# EAGLE design HVAL_TSAL (EAGLE 8.4.1)
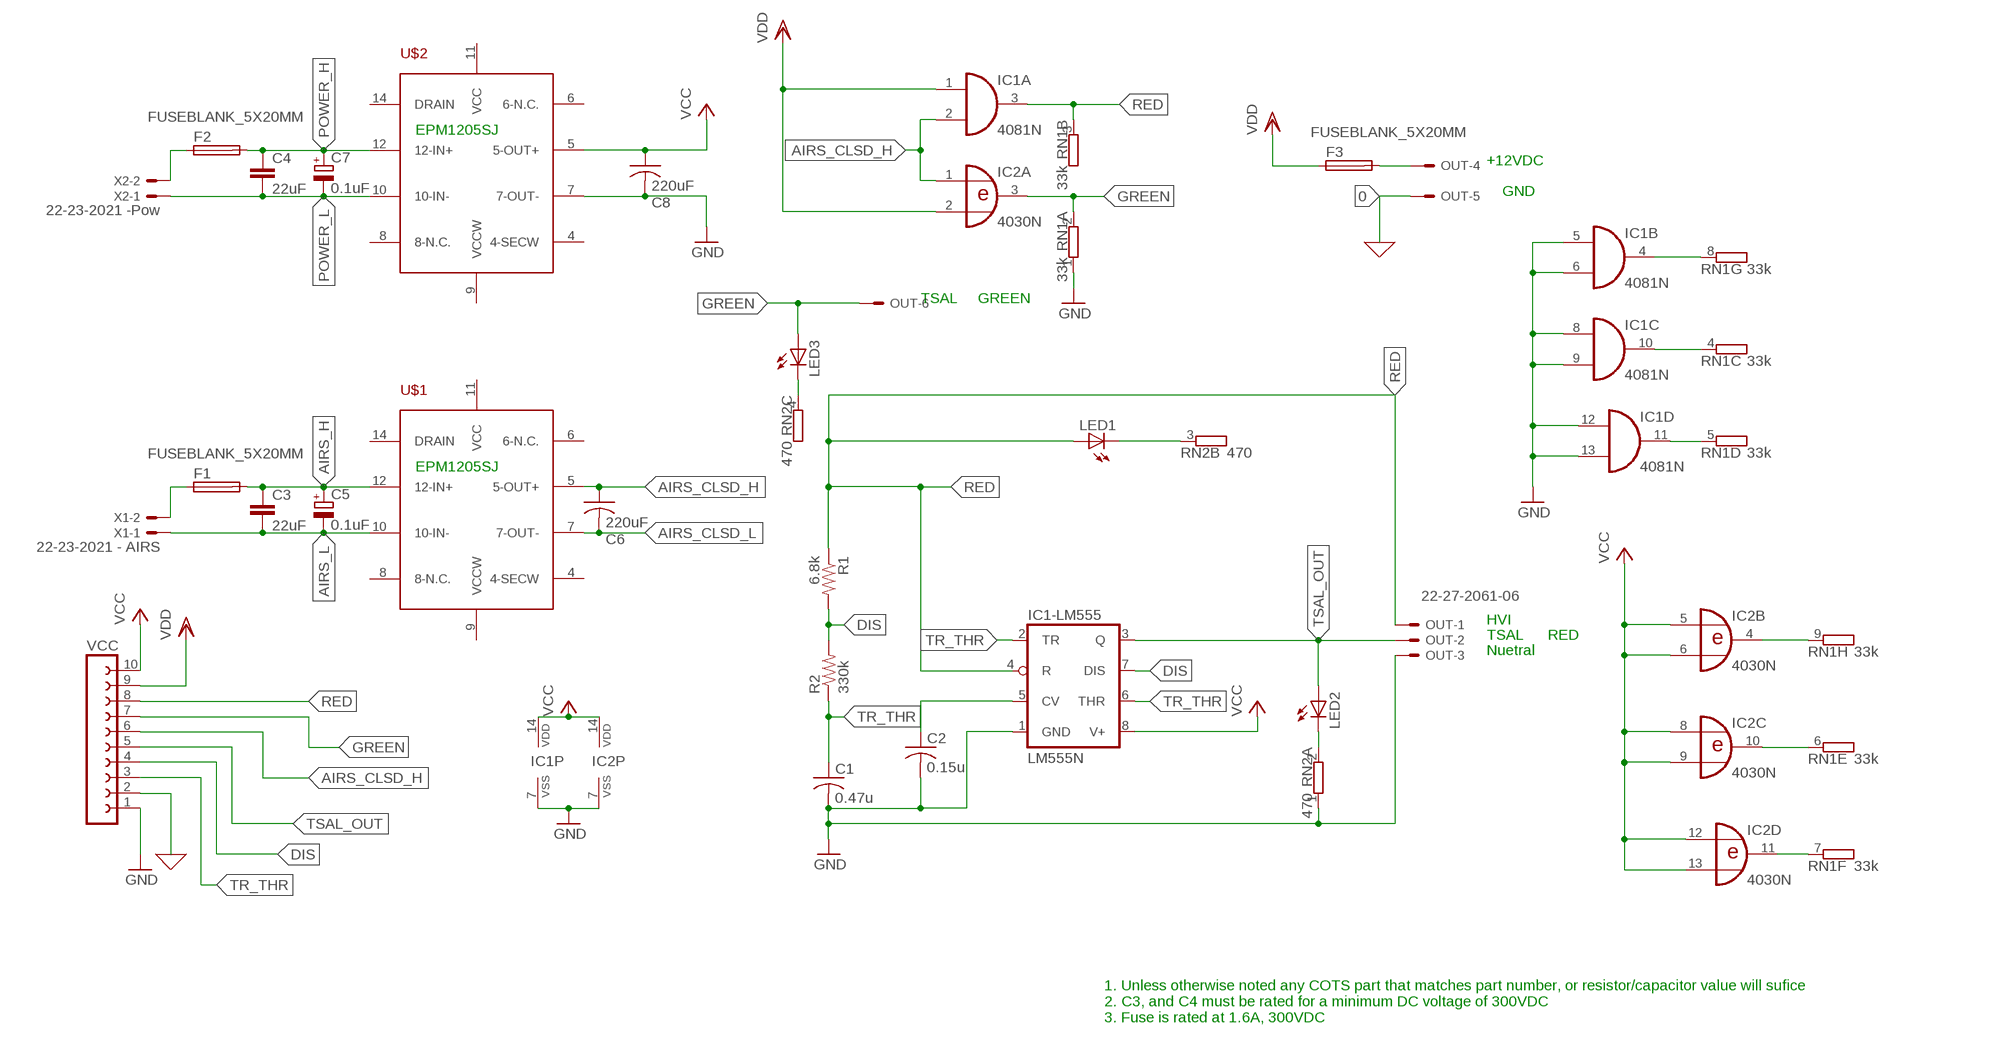
[diagram p0: schematic, sheet 1]

## Parts
C1  0.47u  C-US050-075X075  [C050-075X075]
C2  0.15u  C-US050-075X075  [C050-075X075]
C3  22uF  C-EU150-091X182  [C150-091X182]
C4  22uF  C-EU150-091X182  [C150-091X182]
C5  0.1uF  CPOL-EUE7.5-16  [E7,5-16]
C6  220uF  C-US050-055X075  [C050-055X075]
C7  0.1uF  CPOL-EUE7.5-16  [E7,5-16]
C8  220uF  C-US050-055X075  [C050-055X075]
F1  FUSEBLANK_5X20MM  [FUSE_HOLDER_5X20MM]
F2  FUSEBLANK_5X20MM  [FUSE_HOLDER_5X20MM]
F3  FUSEBLANK_5X20MM  [FUSE_HOLDER_5X20MM]
IC1  4081N  [DIL14]
IC1-LM555  LM555N  [DIL08]
IC2  4030N  [DIL14]
LED1  LED3MM  [LED3MM]
LED2  LED3MM  [LED3MM]
LED3  LED3MM  [LED3MM]
OUT  22-27-2061-06  [6410-06]
R1  6.8k  R-US_0309/12  [0309/12]
R2  330k  R-US_0309/12  [0309/12]
RN1  33k  GE08R  [SIL9]
RN2  470  GE03R  [SIL4]
U$1  EPM1205SJ  [EPM1205SJ]
U$2  EPM1205SJ  [EPM1205SJ]
VCC  FE10-1  [FE10]
X1  22-23-2021 - AIRS  22-23-2021  [22-23-2021]
X2  22-23-2021 -Pow  22-23-2021  [22-23-2021]

## Nets
0: OUT.5 VCC.2 ; supply symbol labelled GND
AIRS_CLSD_H: C6.1 IC1.2(A:I1) IC2.1(A:I0) U$1.5(5-OUT+) VCC.6
AIRS_CLSD_L: C6.2 U$1.7(7-OUT-)
AIRS_H [High Voltage]: C3.1 C5.+ F1.2 U$1.12(12-IN+)
AIRS_L [High Voltage]: C3.2 C5.- U$1.10(10-IN-) X1.1
DIS: IC1-LM555.7(DIS) R1.2 R2.2 VCC.4
GND: C1.2 C2.2 C8.2 IC1-LM555.1(GND) IC1.5(B:I0) IC1.6(B:I1) IC1.7(P:VSS) IC1.8(C:I0) IC1.9(C:I1) IC1.12(D:I0) IC1.13(D:I1) IC2.7(P:VSS) OUT.3 RN1.1 RN2.1 U$2.7(7-OUT-) VCC.1
GREEN: IC2.3(A:O) LED3.A OUT.6 RN1.2 VCC.7
N$1: LED2.K(C) RN2.2
N$2: IC2.10(C:O) RN1.6
N$3: IC1.11(D:O) RN1.5
N$4 [High Voltage]: F2.1 X2.2
N$5: F3.2 OUT.4
N$6: IC1.10(C:O) RN1.4
N$7: C2.1 IC1-LM555.5(CV)
N$8: IC2.4(B:O) RN1.9
N$9: IC1.4(B:O) RN1.8
N$10 [High Voltage]: F1.1 X1.2
N$11: IC2.11(D:O) RN1.7
N$14: LED1.K(C) RN2.3
N$15: LED3.K(C) RN2.4
POWER_H [High Voltage]: C4.1 C7.+ F2.2 U$2.12(12-IN+)
POWER_L [High Voltage]: C4.2 C7.- U$2.10(10-IN-) X2.1
RED: IC1-LM555.4(R) IC1.3(A:O) LED1.A OUT.1 R1.1 RN1.3 VCC.8
TR_THR: C1.1 IC1-LM555.2(TR) IC1-LM555.6(THR) R2.1 VCC.3
TSAL_OUT: IC1-LM555.3(Q) LED2.A OUT.2 VCC.5
VCC: C8.1 IC1-LM555.8(V+) IC1.14(P:VDD) IC2.5(B:I0) IC2.6(B:I1) IC2.8(C:I0) IC2.9(C:I1) IC2.12(D:I0) IC2.13(D:I1) IC2.14(P:VDD) U$2.5(5-OUT+) VCC.10
VDD: F3.1 IC1.1(A:I0) IC2.2(A:I1) VCC.9
Unconnected: U$1.4(4-SECW) U$1.6(6-N.C.) U$1.8(8-N.C.) U$1.9(VCCW) U$1.11(VCC) U$1.14(DRAIN) U$2.4(4-SECW) U$2.6(6-N.C.) U$2.8(8-N.C.) U$2.9(VCCW) U$2.11(VCC) U$2.14(DRAIN)

## Notes on the sheet
- EPM1205SJ
- +12VDC
- GND
- TSAL     GREEN
- EPM1205SJ
- HVI
- TSAL | RED
- Nuetral
- 1. Unless otherwise noted any COTS part that matches part number, or resistor/capacitor value will sufice
  2. C3, and C4 must be rated for a minimum DC voltage of 300VDC
  3. Fuse is rated at 1.6A, 300VDC

## Library data of the parts
C1 C2 C6 C8 = rcl:C-US: CAPACITOR, American symbol; SPICEPREFIX: C
C3 C4 = rcl:C-EU: CAPACITOR, European symbol; SPICEPREFIX: C
C5 C7 = rcl:CPOL-EU: POLARIZED CAPACITOR, European symbol; SPICEPREFIX: C
F1-F3 = fuse:FUSE: Fuse; OC_FARNELL: unknown; OC_NEWARK: unknown
IC1 = 40xx:4081: Quad 2-input AND
IC1-LM555 = linear:*555: TIMER
IC2 = 40xx:4030: Quad XOR
LED1-LED3 = led:LED: LED OSRAM: - CHIPLED LG R971, LG N971, LY N971, LG Q971, LY Q971, LO R971, LY R971 LH N974, LH R974 LS Q976, LO Q976, LY Q976 LO Q996 - Hyper CHIPLED LW Q18S LB Q993, LB Q99A, LB R99A - SideLED LS A670, LO A670, LY A670, LG A670, LP A670 LB A673, LV A673, LT A673, LW A673 LH A674 LY A675 LS A676, LA A676, LO A676, LY A676, LW A676 LS A679, LY A679, LG A679 - Hyper Micro SIDELED® LS Y876, LA Y876, LO Y876, LY Y876 LT Y87S - SmartLED LW L88C, LW L88S LB L89C, LB L89S, LG L890 LS L89K, LO L89K, LY L89K LS L896, LA L896, LO L896, LY L896 - TOPLED LS T670, LO T670, LY T670, LG T670, LP T670 LSG T670, LSP T670, LSY T670, LOP T670, LYG T670 LG T671, LOG T671, LSG T671 LB T673, LV T673, LT T673, LW T673 LH T674 LS T676, LA T676, LO T676, LY T676, LB T676, LH T676, LSB T676, LW T676 LB T67C, LV T67C, LT T67C, LS T67K, LO T67K, LY T67K, LW E67C LS E67B, LA E67B, LO E67B, LY E67B, LB E67C, LV E67C, LT E67C LW T67C LS T679, LY T679, LG T679 LS T770, LO T770, LY T770, LG T770, LP T770 LB T773, LV T773, LT T773, LW T773 LH T774 LS E675, LA E675, LY E675, LS T675 LS T776, LA T776, LO T776, LY T776, LB T776 LHGB T686 LT T68C, LB T68C - Hyper Mini TOPLED® LB M676 - Mini TOPLED Santana® LG M470 LS M47K, LO M47K, LY M47K Source: http://www.osram.convergy.de LUXEON: - LUMILED® LXK2-PW12-R00, LXK2-PW12-S00, LXK2-PW14-U00, LXK2-PW14-V00 LXK2-PM12-R00, LXK2-PM12-S00, LXK2-PM14-U00 LXK2-PE12-Q00, LXK2-PE12-R00, LXK2-PE12-S00, LXK2-PE14-T00, LXK2-PE14-U00 LXK2-PB12-K00, LXK2-PB12-L00, LXK2-PB12-M00, LXK2-PB14-N00, LXK2-PB14-P00, LXK2-PB14-Q00 LXK2-PR12-L00, LXK2-PR12-M00, LXK2-PR14-Q00, LXK2-PR14-R00 LXK2-PD12-Q00, LXK2-PD12-R00, LXK2-PD12-S00 LXK2-PH12-R00, LXK2-PH12-S00 LXK2-PL12-P00, LXK2-PL12-Q00, LXK2-PL12-R00 Source: www.luxeon.com KINGBRIGHT: KA-3528ASYC Source: www.kingbright.com
OUT = con-molex:22-?-06: CONNECTOR wire to board 2.54 mm (.1 inch) pitch header; MF: MOLEX; OC_FARNELL: unknown; OC_NEWARK: unknown
R1 R2 = resistor:R-US_: RESISTOR, American symbol
RN1 = resistor-sil:GE08R: SIL RESISTOR; OC_FARNELL: unknown; OC_NEWARK: unknown
RN2 = resistor-sil:GE03R: SIL RESISTOR; OC_FARNELL: unknown; OC_NEWARK: unknown
U$1 U$2 = DC-DC Converter:EPM1205SJ
VCC = con-lsta:FE10-1: FEMALE HEADER; OC_FARNELL: unknown; OC_NEWARK: unknown
X1 X2 = con-molex:22-23-2021: .100" (2.54mm) Center Header - 2 Pin; MF: MOLEX; MPN: 22-23-2021; OC_FARNELL: 1462926; OC_NEWARK: 25C3832

## Net classes
0 default: width 0.508 mm, drill 0.254 mm, clearance 0.205 mm
1 High Voltage: width 0.762 mm, drill 0.163 mm, clearance 0.5 mm

## Board
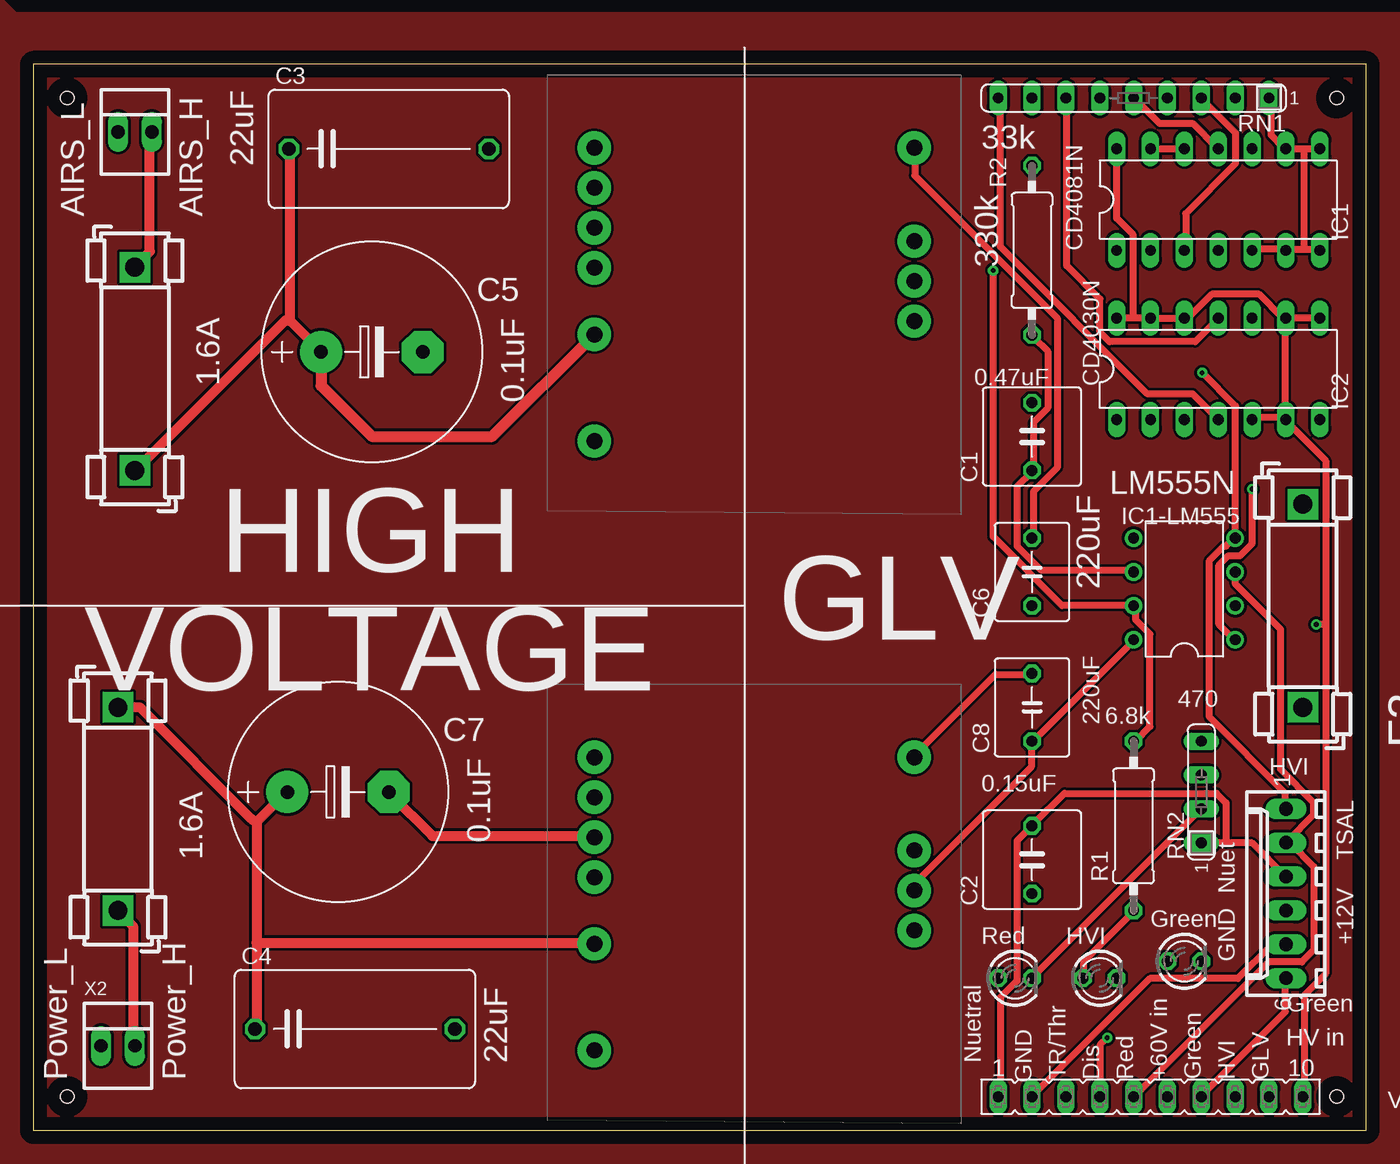
[diagram p1: board, top side]
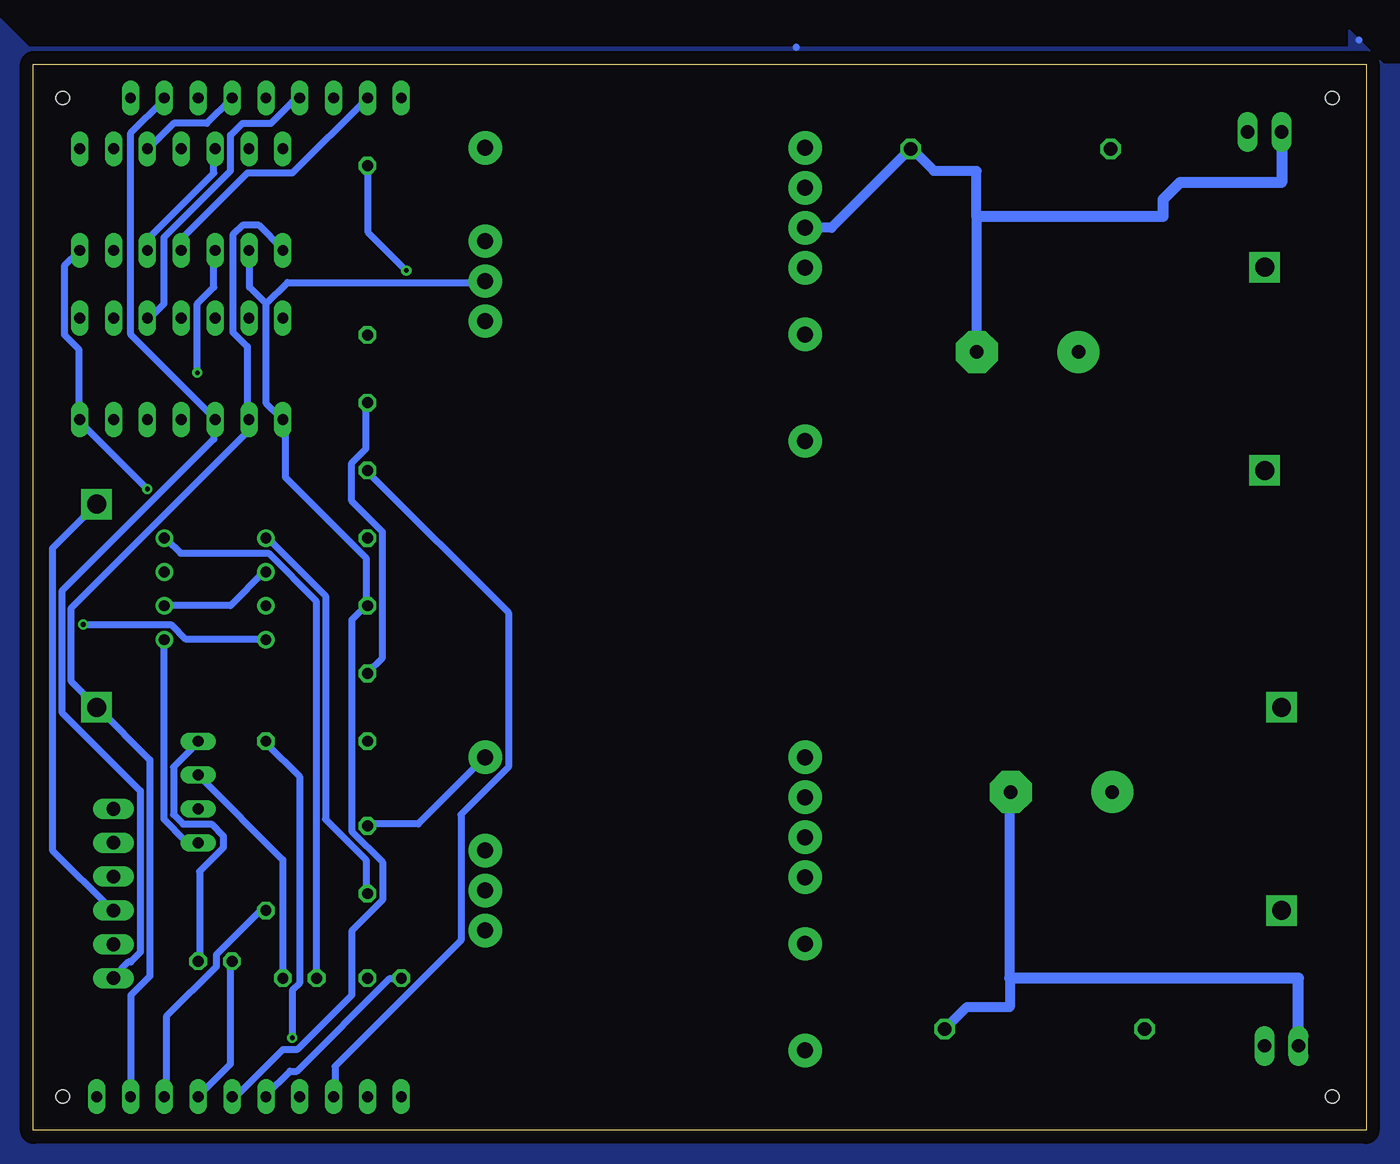
[diagram p2: board, bottom side, seen from below]

Size 100 x 80 mm. Coordinates in mm from the lower left corner, seen from the top.
Outline: 0,0 100,0 100,80 0,80 0,0
Copper layers (1*16): Top 0.035mm / dielectric 1.5mm / Bottom 0.035mm
Design rules "default": minimum track width 6mil, minimum drill 0.35mm, track to track 6mil, track to pad 6mil, pad to pad 6mil, via to via 6mil, smd to smd 6mil, copper to edge 40mil, drill to drill 6mil, minimum pad ring 10mil, minimum via ring 8mil, stop-mask expansion 4mil, vias tented up to drill 0mil, thermal gap 10mil
Holes 1 mm at 2.54,77.47 2.54,2.54 97.79,77.47 97.79,2.54

### Footprints (pad centres in the part's own frame; a part is rotated, then mirrored left to right if it is on the bottom)
C050-075X075 = drill 0.813 octagon: 1 -2.54,0; 2 2.54,0
C150-091X182 = drill 1.016 octagon: 1 -7.493,0; 2 7.493,0
E7,5-16 = drill 1.016 pad 3.15: + -3.81,0 | drill 1.016 pad 3.15 octagon: - 3.81,0
C050-055X075 = drill 0.813 octagon: 1 -2.54,0; 2 2.54,0
FUSE_HOLDER_5X20MM = drill 1.422 pad 2.286 square: 1 0,0; 2 15.24,0
DIL14 = drill 0.813 long: 1 -7.62,-3.81; 2 -5.08,-3.81; 3 -2.54,-3.81; 4 0,-3.81; 5 2.54,-3.81; 6 5.08,-3.81; 7 7.62,-3.81; 8 7.62,3.81; 9 5.08,3.81; 10 2.54,3.81; 11 0,3.81; 12 -2.54,3.81; 13 -5.08,3.81; 14 -7.62,3.81
DIL08 = drill 0.813 pad 1.27: 1 -3.81,-3.81; 2 -1.27,-3.81; 3 1.27,-3.81; 4 3.81,-3.81; 5 3.81,3.81; 6 1.27,3.81; 7 -1.27,3.81; 8 -3.81,3.81
LED3MM = drill 0.813 octagon: A -1.27,0; K 1.27,0
6410-06 = drill 1.016 long: 1 6.35,0; 2 3.81,0; 3 1.27,0; 4 -1.27,0; 5 -3.81,0; 6 -6.35,0
0309/12 = drill 0.813 octagon: 1 -6.35,0; 2 6.35,0
SIL9 = drill 0.813 long: 1 -10.16,0; 2 -7.62,0; 3 -5.08,0; 4 -2.54,0; 5 0,0; 6 2.54,0; 7 5.08,0; 8 7.62,0; 9 10.16,0
SIL4 = drill 0.813 long: 1 -3.81,0; 2 -1.27,0; 3 1.27,0; 4 3.81,0
EPM1205SJ = drill 1.2 pad 2.5: 4 12.75,-1.5; 5 12.75,1.5; 6 12.75,4.5; 7 12.75,11.5; 8 -11.25,11.5; 9 -11.25,8.5; 10 -11.25,5.5; 11 -11.25,2.5; 12 -11.25,-2.5; 14 -11.25,-10.5
FE10 = drill 0.813 long: 1 -11.43,0; 2 -8.89,0; 3 -6.35,0; 4 -3.81,0; 5 -1.27,0; 6 1.27,0; 7 3.81,0; 8 6.35,0; 9 8.89,0; 10 11.43,0
22-23-2021 = drill 1 long: 1 -1.27,0; 2 1.27,0

### Placement (x,y rotation side)
C1  74.93,52.07 90 top
C2  74.93,20.32 90 top
C3  26.67,73.66 0 top
C4  24.13,7.62 0 top
C5  25.4,58.42 0 top
C6  74.93,41.91 90 top
C7  22.86,25.4 0 top
C8  74.93,31.75 90 top
F1  7.62,64.77 270 top
F2  6.35,16.51 90 top
F3  95.25,31.75 90 top
IC1  88.9,69.85 0 top
IC1-LM555  86.36,40.64 90 top
IC2  88.9,57.15 0 top
LED1  80.01,11.43 0 top
LED2  73.66,11.43 0 top
LED3  86.36,12.7 0 top
OUT  93.98,17.78 90 top
R1  82.55,22.86 90 top
R2  74.93,66.04 90 top
RN1  82.55,77.47 180 top
RN2  87.63,25.4 90 top
U$1  53.34,62.23 0 top
U$2  53.34,16.51 0 top
VCC  83.82,2.54 0 top
X1  7.62,74.93 0 top
X2  6.35,6.35 0 top

### Tracks (layer width: path | path; a pad name or v marks a point on that pad's centre or on a via)
0
  Top 0.508: VCC.2 75.04,2.67 83.78,11.41 90.37,11.41 92.87,13.9 93.94,13.9 OUT.5
AIRS_CLSD_H
  Bottom 0.508: 82.53,62.03 83.78,63.28 83.78,65.95 IC1.2 | 82.53,62.03 82.53,54.54 81.46,53.48 IC2.1 81.1,53.3 81.1,49.02 75.04,42.96 75.04,39.39 C6.1 75.22,39.22 76.11,38.32 76.11,22.46 73.8,20.14 73.8,17.29 76.11,14.97 76.11,10.16 80.21,6.06 81.28,6.06 84.67,2.67 85.03,2.67 VCC.6 | 82.53,62.03 80.92,63.63 66.13,63.63 U$1.5
AIRS_CLSD_L
  Top 0.508: C6.2 75.04,44.56 75.04,47.95 76.83,49.73 76.83,60.96 66.13,71.66 66.13,73.62 U$1.7
AIRS_H
  Top 0.762: 19.25,60.78 19.25,73.62 C3.1 | 19.25,60.78 21.57,58.47 C5.+ | F1.2 7.67,49.55 18.89,60.78 19.25,60.78
  Top 0.813: C5.+ 21.59,55.88 25.4,52.07 34.43,52.07 U$1.12
AIRS_L
  Bottom 0.762: 6.42,74.86 X1.1 | U$1.10 42.07,67.73 40.11,67.73 34.4,73.44 C3.2 34.05,73.62 32.44,72.01 29.23,72.01 29.23,68.58 29.23,58.47 C5.-
  Bottom 0.813: X1.1 6.35,71.12 13.97,71.12 15.24,69.85 15.24,68.58 29.23,68.58
DIS  (via drill 0.35)
  Top 0.508: v80.57,6.95 80.03,6.42 80.03,2.67 VCC.4 | R1.2 82.71,29.23 83.78,30.3 83.78,37.25 82.71,38.32 82.71,39.22 IC1-LM555.7 82.35,39.39 77.18,39.39 72.01,44.56 v72.01,64.53
  Bottom 0.508: v80.57,6.95 80.57,10.52 80.03,11.05 80.03,26.56 82.53,29.05 R1.2 | v72.01,64.53 74.86,67.38 74.86,72.37 R2.2
GND  (via drill 0.35)
  Top 0.508: 95.36,73.62 96.43,73.62 IC1.8 | 95.36,73.62 94.12,73.62 IC1.9 93.76,73.8 92.87,74.69 92.87,77.36 RN1.1 | IC1.13 83.96,73.62 86.27,73.62 IC1.12 | IC1.5 91.44,66.13 93.94,66.13 IC1.6 94.12,66.13 95.36,66.13 | 95.36,66.13 96.43,66.13 IC1.7 | 95.36,66.13 95.36,73.62 | 89.48,21.57 91.44,21.57 93.94,19.07 OUT.3 | 89.48,21.57 87.7,21.57 RN2.1 | VCC.1 72.55,2.67 72.55,9.98 73.8,11.23 73.8,21.75 74.86,22.82 C2.2 75.04,22.99 77.36,25.31 88.77,25.31 89.48,24.6 89.48,21.57 | C8.2 74.86,34.22 72.19,34.22 66.13,28.16 U$2.7 | v91.44,48.13 91.44,44.03 90.55,43.14 89.66,43.14 88.95,42.42 88.95,37.97 90.02,36.9 IC1-LM555.1
  Bottom 0.508: IC1.12 86.45,73.62 86.45,71.83 91.26,67.02 91.26,66.13 IC1.5 | IC1.7 96.61,65.95 97.68,64.88 97.68,59.71 96.61,58.64 96.61,53.48 IC2.7 96.43,53.12 v91.44,48.13 | IC1-LM555.1 90.19,36.72 90.19,23.35 88.59,21.75 87.7,21.75 RN2.1 | C1.2 75.04,54.54 75.04,51.16 76.11,50.09 76.11,47.24 73.8,44.92 73.8,35.47 74.86,34.4 C8.2 | C2.2 74.86,22.99 71.12,22.99 66.13,27.98 U$2.7
GREEN
  Top 0.508: OUT.6 93.94,11.41 93.94,8.91 87.7,2.67 VCC.7
  Bottom 0.508: RN1.2 90.19,77.36 92.69,74.86 92.69,59.71 86.45,53.48 IC2.3 86.45,53.12 86.45,51.87 97.86,40.46 97.86,31.37 91.98,25.49 91.98,13.37 92.69,12.66 92.87,12.66 93.94,11.59 OUT.6 | LED3.A 85.2,12.66 85.2,4.99 87.52,2.67 VCC.7
N$1
  Top 0.508: LED2.K 75.04,11.59 87.52,24.06 RN2.2
N$2
  Bottom 0.508: RN1.6 80.03,77.36 80.39,77.36 82.17,75.58 84.31,75.58 85.2,74.69 85.2,72.01 90.19,67.02 90.19,62.03 91.26,60.96 IC2.10
N$3
  Top 0.508: IC1.11 88.77,73.8 86.99,75.58 84.49,75.58 82.71,77.36 RN1.5
N$4
  Top 0.762: X2.2 7.49,6.42 7.49,15.33 6.42,16.4 F2.1
N$5
  Bottom 0.508: OUT.4 94.12,16.58 98.57,21.03 98.57,43.67 95.36,46.88 F3.2
N$6
  Bottom 0.508: IC1.10 91.26,73.8 89.48,75.58 86.99,75.58 85.2,77.36 RN1.4
N$7
  Bottom 0.508: C2.1 75.04,17.82 75.04,20.32 78.07,23.35 78.07,40.11 82.53,44.56 IC1-LM555.5
N$8
  Top 0.508: RN1.9 72.55,77.36 72.55,66.31 83.6,55.26 86.99,55.26 88.77,53.48 IC2.4
N$9
  Bottom 0.508: IC1.4 88.77,66.13 88.77,67.02 83.96,71.83 80.57,71.83 75.04,77.36 RN1.8
N$10
  Top 0.762: X1.2 8.73,74.86 8.73,65.95 7.67,64.88 F1.1
N$11
  Top 0.508: RN1.7 77.54,77.36 77.54,64.88 80.03,62.39 80.03,59.89 80.75,59.18 87.16,59.18 88.77,60.78 IC2.11
N$12
  pour Top: -2.54,85.09 -2.54,-7.62 113.03,-7.62 114.3,-6.35 114.3,73.66 104.14,83.82 -1.27,83.82
N$13
  Bottom 0.508: 0.54,81.82 | 42.78,81.28
  pour Bottom: 1.27,82.55 -1.27,80.01 -2.54,80.01 -2.54,-3.81 -1.27,-5.08 5.08,-11.43 106.68,-11.43 105.41,-10.16 105.41,86.36 100.33,81.28 1.27,81.28
N$14
  Bottom 0.508: LED1.K 81.28,11.59 81.28,20.32 87.52,26.56 RN2.3
N$15
  Bottom 0.508: LED3.K 87.52,12.83 87.52,19.43 85.74,21.21 85.74,22.1 86.63,22.99 88.77,22.99 89.48,23.71 89.48,27.27 87.7,29.05 RN2.4
POWER_H
  Top 0.762: 16.76,23.17 16.76,14.08 | 16.76,14.08 16.76,7.67 C4.1 | 16.76,23.17 18.89,25.31 C7.+ | F2.2 6.42,31.73 8.02,31.73 16.4,23.35 16.76,23.17 | 16.76,14.08 42.07,14.08 U$2.12
POWER_L
  Top 0.762: U$2.10 42.07,22.1 29.95,22.1 26.74,25.31 C7.-
  Bottom 0.762: C4.2 31.55,7.67 29.95,9.27 26.74,9.27 26.74,11.43 26.74,25.31 C7.-
  Bottom 0.813: X2.1 5.08,11.43 26.74,11.43
RED  (via drill 0.35)
  Top 0.508: IC1.3 86.45,66.13 86.45,68.81 90.19,72.55 90.19,74.86 87.7,77.36 RN1.3 | LED1.A 78.79,11.59 78.79,12.66 82.53,16.4 R1.1 | OUT.1 93.94,24.24 93.94,25.31 88.23,31.02 88.23,42.78 89.3,43.85 89.48,43.85 90.02,44.38 IC1-LM555.4 90.19,44.56 90.19,54.37 v87.7,56.86
  Bottom 0.508: VCC.8 90.02,2.67 90.02,8.56 86.27,12.3 86.27,13.19 83.06,16.4 82.71,16.4 R1.1 | v87.7,56.86 87.7,62.03 86.45,63.28 86.45,65.95 IC1.3 | LED1.A 78.79,11.59 78.79,39.75 82.35,43.31 88.95,43.31 90.02,44.38 IC1-LM555.4
TR_THR
  Top 0.508: R2.1 75.04,59.53 76.11,58.47 76.11,54.19 75.04,53.12 75.04,49.55 C1.1 74.86,49.38 73.8,48.31 73.8,43.85 75.58,42.07 82.53,42.07 IC1-LM555.6
  Bottom 0.508: IC1-LM555.2 90.02,39.39 85.2,39.39 82.71,41.89 IC1-LM555.6 | VCC.3 77.36,2.67 77.36,4.81 67.91,14.26 67.91,23.71 64.35,27.27 64.35,38.86 74.86,49.38 C1.1
TSAL_OUT
  Top 0.508: IC1-LM555.3 90.19,41.89 90.19,41 93.58,37.61 93.58,27.09 96.08,24.6 96.08,23.71 94.12,21.75 OUT.2 94.29,21.57 96.08,19.79 96.08,13.55 95.19,12.66 92.69,12.66 82.71,2.67 VCC.5
  Bottom 0.508: LED2.A 72.55,11.41 73.26,11.41 80.21,4.46 80.75,4.46 82.53,2.67 VCC.5
VCC  (via drill 0.35)
  Top 0.508: 82.53,60.96 83.78,60.96 IC2.13 83.96,60.96 86.27,60.96 IC2.12 86.45,61.14 86.81,61.14 88.41,62.74 91.98,62.74 93.76,60.96 IC2.9 | 82.53,60.96 IC2.14 | 82.53,60.96 82.53,67.2 81.28,68.45 81.28,73.62 IC1.14 | IC2.9 94.12,60.96 96.43,60.96 IC2.8 | IC2.9 93.94,60.78 93.94,53.48 IC2.6 | IC2.5 91.62,53.48 93.76,53.48 IC2.6 | IC1-LM555.8 82.53,36.72 75.04,29.23 C8.1 74.86,29.05 74.86,27.27 66.13,18.54 66.13,18.18 U$2.5 | 96.97,37.97 96.97,50.27 94.12,53.12 IC2.6 | 96.97,37.97 96.97,11.76 95.36,10.16 95.36,2.67 VCC.10 | 96.97,37.97 v96.25,37.97
  Bottom 0.508: v96.25,37.97 89.66,37.97 88.59,36.9 82.71,36.9 IC1-LM555.8
VDD
  Bottom 0.508: IC1.1 81.28,66.13 83.06,67.91 84.31,67.91 85.03,67.2 85.03,59.89 83.96,58.82 83.96,53.48 IC2.2 83.96,53.12 83.96,52.41 97.15,39.22 97.15,33.69 95.36,31.91 F3.1 95.19,31.73 91.26,27.81 91.26,11.59 92.69,10.16 92.69,2.67 VCC.9

### Text on the board
tNames: 33k | 22uF | AIRS_L | AIRS_H | CD4081N | 330k | 0.47uF | 1.6A | CD4030N | 0.1uF | LM555N | HIGH | 220uF | GLV | VOLTAGE | 470 | 6.8k | 220uF | HVI | 0.15uF | 0.1uF | 1.6A | TSAL | Nuet | Green | Red | HVI | +12V | GND | Green | Green | GND | HV in | 22uF | Nuetral | Power_L | Power_H | TR/Thr | Dis | Red | +60V in | HVI | GLV